# EAGLE design Voltage Divider Brick (EAGLE 9.6.1)
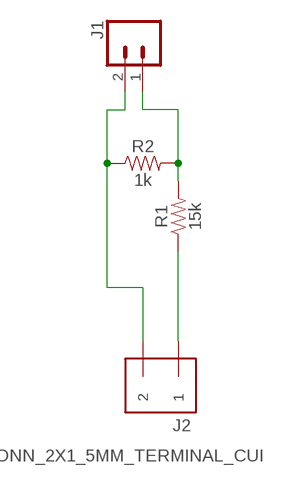
[diagram p0: schematic, sheet 1]

## Parts
J1  CONN_02POLAR_LOCK  [MOLEX-1X2_LOCK]
J2  CONN_2X1_5MM_TERMINAL_CUI  [CONN_2X1_5MM_TERMINAL_CUI_HOLE]
R1  15k  15KOHM-HORIZ-1/4W-5%  [AXIAL-0.3]
R2  1k  1KOHM-HORIZ-1/4W-1%  [AXIAL-0.3]

## Nets
N$1: J1.1 R1.P$2 R2.P$2
N$2: J2.P$1 R1.P$1
N$3: J1.2 J2.P$2 R2.P$1

## Library data of the parts
J1 = SparkFun-Connectors:CONN_02: Multi connection point. Often used as Generic Header-pin footprint for 0.1 inch spaced/style header connections On any of the 0.1 inch spaced packages, you can populate with these: Break Away Headers - Straight <https://www.sparkfun.com/products/116> (PRT-00116) Break Away Male Headers - Right Angle <https://www.sparkfun.com/products/553> (PRT-00553) Female Headers <https://www.sparkfun.com/products/115> (PRT-00115) Break Away Headers - Machine Pin <https://www.sparkfun.com/products/117> (PRT-00117) Break Away Female Headers - Swiss Machine Pin <https://www.sparkfun.com/products/743> (PRT-00743) For SCREWTERMINALS and SPRING TERMINALS visit here: Screw Terimnals on SparkFun.com <https://www.sparkfun.com/search/results?term=Screw+Terminals> (5mm/3.5mm/2.54mm spacing) This device is also useful as a general connection point to wire up your design to another part of your project. Our various solder wires solder well into these plated through hole pads. Hook-Up Wire - Assortment (Stranded, 22 AWG) <https://www.sparkfun.com/products/11375> (PRT-11375) Hook-Up Wire - Assortment (Solid Core, 22 AWG) <https://www.sparkfun.com/products/11367> (PRT-11367) View the entire wire category on our website here <https://www.sparkfun.com/categories/141> Special notes: Molex polarized connector foot print use with: PRT-08233 with associated crimp pins and housings. 2.54_SCREWTERM for use with PRT-10571. 3.5mm Screw Terminal footprints for PRT-08084 5mm Screw Terminal footprints for use with PRT-08432; SF_ID: PRT-09918
J2 = dave-connectors:CONN_2X1_5MM_TERMINAL_CUI: 2 position screw terminal with 5mm pitch
R1 = SparkFun-Resistors:15KOHM: 15kΩ resistor A resistor is a passive two-terminal electrical component that implements electrical resistance as a circuit element. Resistors act to reduce current flow, and, at the same time, act to lower voltage levels within circuits. - Wikipedia; PROD_ID: RES-11360
R2 = SparkFun-Resistors:1KOHM: 1kΩ resistor A resistor is a passive two-terminal electrical component that implements electrical resistance as a circuit element. Resistors act to reduce current flow, and, at the same time, act to lower voltage levels within circuits. - Wikipedia; PROD_ID: RES-12182

## Board
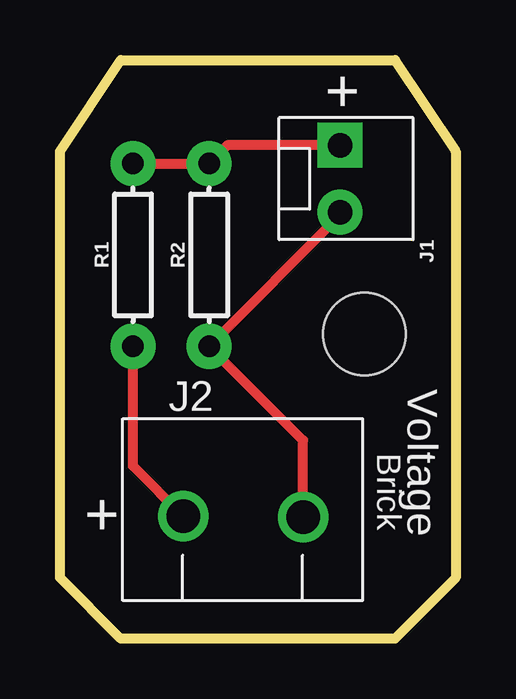
[diagram p1: board, top side]
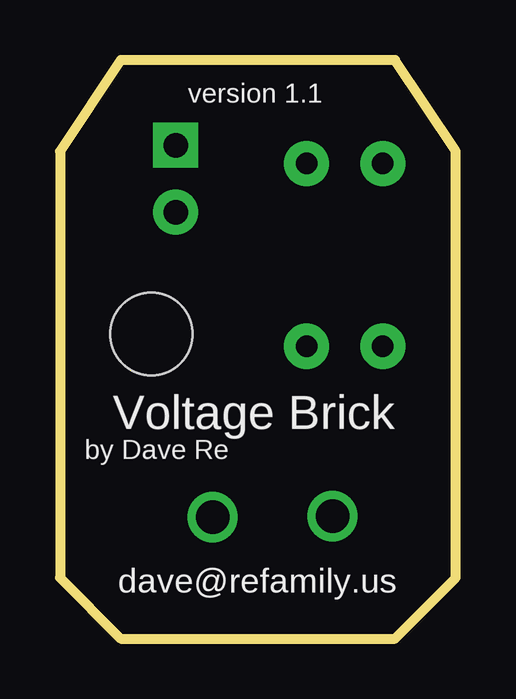
[diagram p2: board, bottom side, seen from below]

Size 16.51 x 24.13 mm. Coordinates in mm from the lower left corner, seen from the top.
Outline: 2.54,0 0,2.54 0,20.32 2.54,24.13 13.97,24.13 16.51,20.32 16.51,2.54 13.97,0 2.54,0
Copper layers (1*16): Top 0.035mm / dielectric 1.5mm / Bottom 0.035mm
Design rules "default": minimum track width 6mil, minimum drill 0.35mm, track to track 6mil, track to pad 6mil, pad to pad 6mil, via to via 6mil, smd to smd 6mil, copper to edge 40mil, drill to drill 6mil, minimum pad ring 10mil, minimum via ring 8mil, stop-mask expansion 4mil, vias tented up to drill 0mil, thermal gap 10mil
Holes 3.43 mm at 12.7,12.7

### Footprints (pad centres in the part's own frame; a part is rotated, then mirrored left to right if it is on the bottom)
MOLEX-1X2_LOCK = drill 1.016 pad 1.88 square: 1 -0.127,0 | drill 1.016 pad 1.88: 2 2.667,0
CONN_2X1_5MM_TERMINAL_CUI_HOLE = drill 1.397: P$1 -2.476,0.024; P$2 2.524,-0.013
AXIAL-0.3 = drill 0.9 pad 1.88: P$1 -3.81,0; P$2 3.81,0

### Placement (x,y rotation side)
J1  11.68,20.45 270 top
J2  7.62,5.08 0 top
R1  3.05,16 90 top
R2  6.22,16 90 top

### Tracks (layer width: path | path; a pad name or v marks a point on that pad's centre or on a via)
N$1
  Top 0.406: R1.P$2 R2.P$2 6.99,20.57 J1.1
N$2
  Top 0.406: J2.P$1 3.05,7.2 R1.P$1
N$3
  Top 0.406: J1.2 11.68,17.65 R2.P$1 10.14,8.27 J2.P$2

### Text on the board
tPlace: + | Voltage | Brick | +
bPlace: version 1.1 | Voltage Brick | by Dave Re | dave@refamily.us